# Altium project Project-Files-v2.PrjPcb
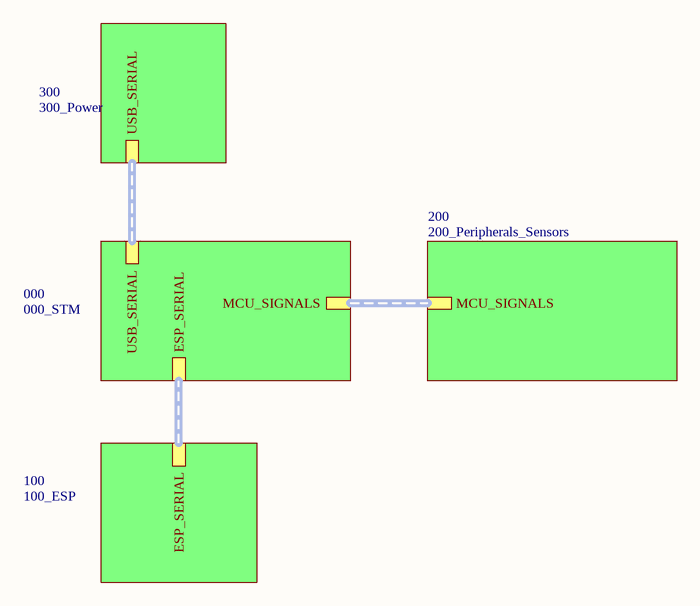
[diagram p0: Main.SchDoc]
4 sheets, 59 parts. Net scope: hierarchical (ports join the sheet entries above them; power ports are global).
Board file: PBC-full.PcbDoc
Sheets:
  Main.SchDoc
    100 = 100_ESP.SchDoc
    200 = 200_Peripherals_Sensors.SchDoc
    300 = 300_Power.SchDoc

## Sheet Main.SchDoc
size A; SheetNumber: 1; SheetTotal: 5

### Sub-sheets
000 = 000_STM (file not in this document): MCU_SIGNALS (harness MCU_SIGNALS), USB_SERIAL (harness USB_SERIAL), ESP_SERIAL (harness ESP_SERIAL)
100 = 100_ESP: ESP_SERIAL (harness ESP_SERIAL)
200 = 200_Peripherals_Sensors: MCU_SIGNALS (harness MCU_SIGNALS)
300 = 300_Power: USB_SERIAL (harness USB_SERIAL)

### Buses and harness runs
harness sheet 000/ESP_SERIAL = sheet 100/ESP_SERIAL
harness sheet 000/MCU_SIGNALS = sheet 200/MCU_SIGNALS
harness sheet 000/USB_SERIAL = sheet 300/USB_SERIAL

## Sheet 100_ESP.SchDoc
size A; SheetNumber: 3; SheetTotal: 5
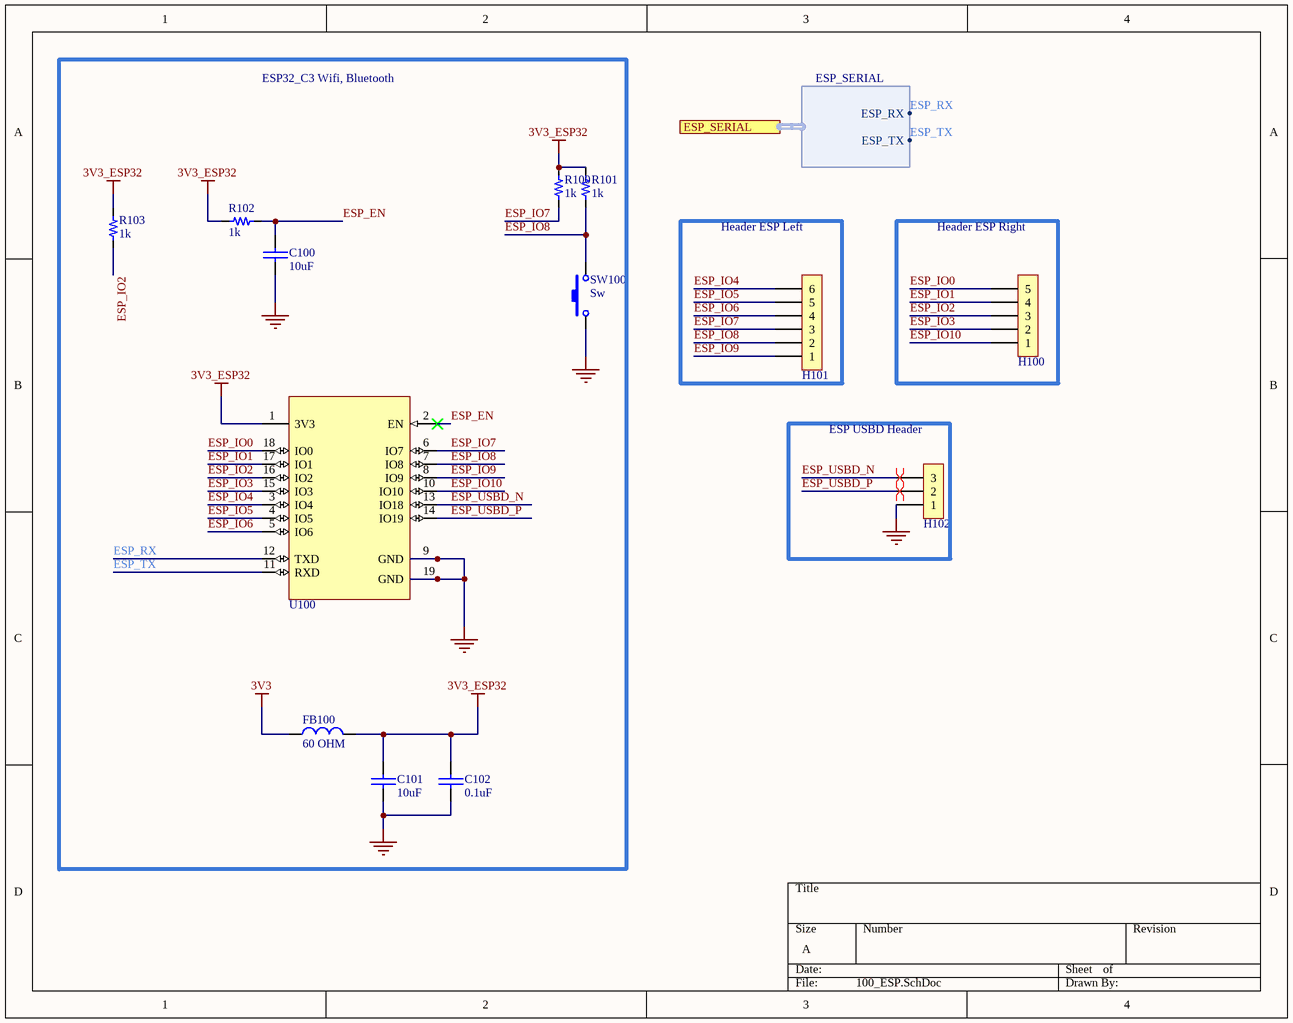
[diagram p1: 100_ESP.SchDoc]

### Parts
C100  value 10uF  [0805_cap]  (hidden comment: 10uF 25V)
C101  value 10uF  [0805_cap]  (hidden comment: 10uF 25V)
C102  value 0.1uF  [0603_cap]  (hidden comment: 0.1uF 50V)
FB100  value 60 OHM  [0603_fb]  (hidden comment: 60OHM 2A)
H100  5x1  [H_5x1_TH_100mil]  (value not drawn)  (no BOM)
H101  6x1  [H_6x1_TH_100mil]  (value not drawn)  (no BOM)
H102  3x1  [H_3X1_TH_100mil]  (value not drawn)  (no BOM)
R100  value 1k  [0603_res]  (hidden comment: 1k 1/10W)
R101  value 1k  [0603_res]  (hidden comment: 1k 1/10W)
R102  value 1k  [0603_res]  (hidden comment: 1k 1/10W)
R103  value 1k  [0603_res]  (hidden comment: 1k 1/10W)
SW100  Sw  [Sw_PUSH_4.5x4.5x5mm]
U100  ESP32-C3-WROOM-02-N4  [ESP32-C3-WROOM-02-N4]  (value not drawn)

### Blocks framed on the sheet
ESP32_C3 Wifi, Bluetooth: C100-C102 FB100 R100-R103 SW100 U100
Header ESP Left: H101
Header ESP Right: H100
ESP USBD Header: H102

### Ports
ESP_SERIAL (harness ESP_SERIAL, see Main[2B], 000_STM[3C])

### Harnesses
ESP_SERIAL: ESP_RX, ESP_TX

### Nets
3V3: FB100.1
3V3_ESP32: C101.1 C102.1 FB100.2 R100.2 R101.2 R102.2 R103.2 U100.1(3V3)
GND: C100.2 C101.2 C102.2 H102.1 SW100.1 U100.9(GND) U100.19(GND)
ESP_EN: C100.1 R102.1 U100.2(EN)
ESP_IO0: H100.5 U100.18(IO0)
ESP_IO1: H100.4 U100.17(IO1)
ESP_IO2: H100.3 R103.1 U100.16(IO2)
ESP_IO3: H100.2 U100.15(IO3)
ESP_IO4: H101.6 U100.3(IO4)
ESP_IO5: H101.5 U100.4(IO5)
ESP_IO6: H101.4 U100.5(IO6)
ESP_IO7: H101.3 R100.1 U100.6(IO7)
ESP_IO8: H101.2 R101.1 SW100.2 U100.7(IO8)
ESP_IO9: H101.1 U100.8(IO9)
ESP_IO10: H100.1 U100.10(IO10)
ESP_RX: U100.12(TXD) ; port ESP_SERIAL.ESP_RX
ESP_TX: U100.11(RXD) ; port ESP_SERIAL.ESP_TX
ESP_USBD_N: H102.3 U100.13(IO18)
ESP_USBD_P: H102.2 U100.14(IO19)

### Layout directives
differential pair; differential pair class USB_2.0_ESP: ESP_USBD_N, ESP_USBD_P

### Library data of the parts
C100 C101 = Cap_10uF_0805_25V_: 25V 10uF X5R ±10% 0805 Multilayer Ceramic Capacitors MLCC - SMD/SMT ROHS; Manufacturer: Samsung Electro-Mechanics; Manufacturer Part Number: CL21A106KAYNNNE; Supplier 1: LCSC; Supplier Part Number 1: C15850; ComponentLink1Description: LCSC; ComponentLink1URL: https://lcsc.com/product-detail/Multilayer-Ceramic-Capacitors-MLCC-SMD-SMT_Samsung-Electro-Mechanics-CL21A106KAYNNNE_C15850.html
C102 = Cap_0.1uF_0603_50V: 50V 100nF Y5V -20%~+80% 0603 Multilayer Ceramic Capacitors MLCC - SMD/SMT ROHS; Manufacturer: Walsin Tech Corp; Manufacturer Part Number: 0603F104Z500CT; Supplier 1: LCSC; Supplier Part Number 1: C83060; ComponentLink1Description: LCSC; ComponentLink1URL: https://www.lcsc.com/product-detail/Multilayer-Ceramic-Capacitors-MLCC-SMD-SMT_Walsin-Tech-Corp-0603F104Z500CT_C83060.html
FB100 = FB_60_0603_2A: 2A 1 100mΩ 60Ω@100MHz ±25% 0603 Ferrite Beads ROHS; Manufacturer: TAI-TECH; Manufacturer Part Number: HCB1608KF-600T20; ComponentLink1Description: LCSC; ComponentLink1URL: https://www.lcsc.com/product-detail/Ferrite-Beads_TAI-TECH-HCB1608KF-600T20_C369516.html; Supplier 1: LCSC; Supplier Part Number 1: C369516
H100 = H_Male_5x1_TH_100mil: ComponentLink1Description: LCSC
H101 = H_Male_6x1_TH_100mil: ComponentLink1Description: LCSC
H102 = H_Male_3x1_TH_100mil: ComponentLink1Description: LCSC
R100-R103 = Res_1k_0603_1/10W: RES SMD 1k OHM 5% 1/10W 0603; Manufacturer: FOJAN; Manufacturer Part Number: FRC0603J102 TS; ComponentLink1URL: https://www.lcsc.com/product-detail/Chip-Resistor-Surface-Mount_FOJAN-FRC0603J102-TS_C2907113.html; Supplier 1: LCSC; Supplier Part Number 1: C2907113; ComponentLink1Description: LCSC
SW100 = Sw_PUSH_4.5x4.5x5.0xmm: SWITCH TACTILE SPST-NO 0.05A 12V; Manufacturer: BZCN; Manufacturer Part Number: TSC015A05026A; Supplier 1: LCSC; Supplier Part Number 1: C2888509; Last modified by: N-A.Potosi; Last modified date: 20190222; ComponentLink1Description: LCSC; ComponentLink1URL: https://www.lcsc.com/product-detail/Tactile-Switches_BZCN-TSC015A05026A_C2888509.html
U100 = MCU_ESP32-C3-WROOM-02-N4: RF TXRX MOD BT WIFI PCB TH SMD; Manufacturer: Espressif Systems; Manufacturer Part Number: ESP32-C3-WROOM-02-N4; Supplier 1: LCSC; Supplier Part Number 1: C2934560; ComponentLink1Description: LCSC; ComponentLink1URL: https://lcsc.com/product-detail/WiFi-Modules_Espressif-Systems-ESP32-C3-WROOM-02-N4_C2934560.html

## Sheet 200_Peripherals_Sensors.SchDoc
size A; SheetNumber: 4; SheetTotal: 5
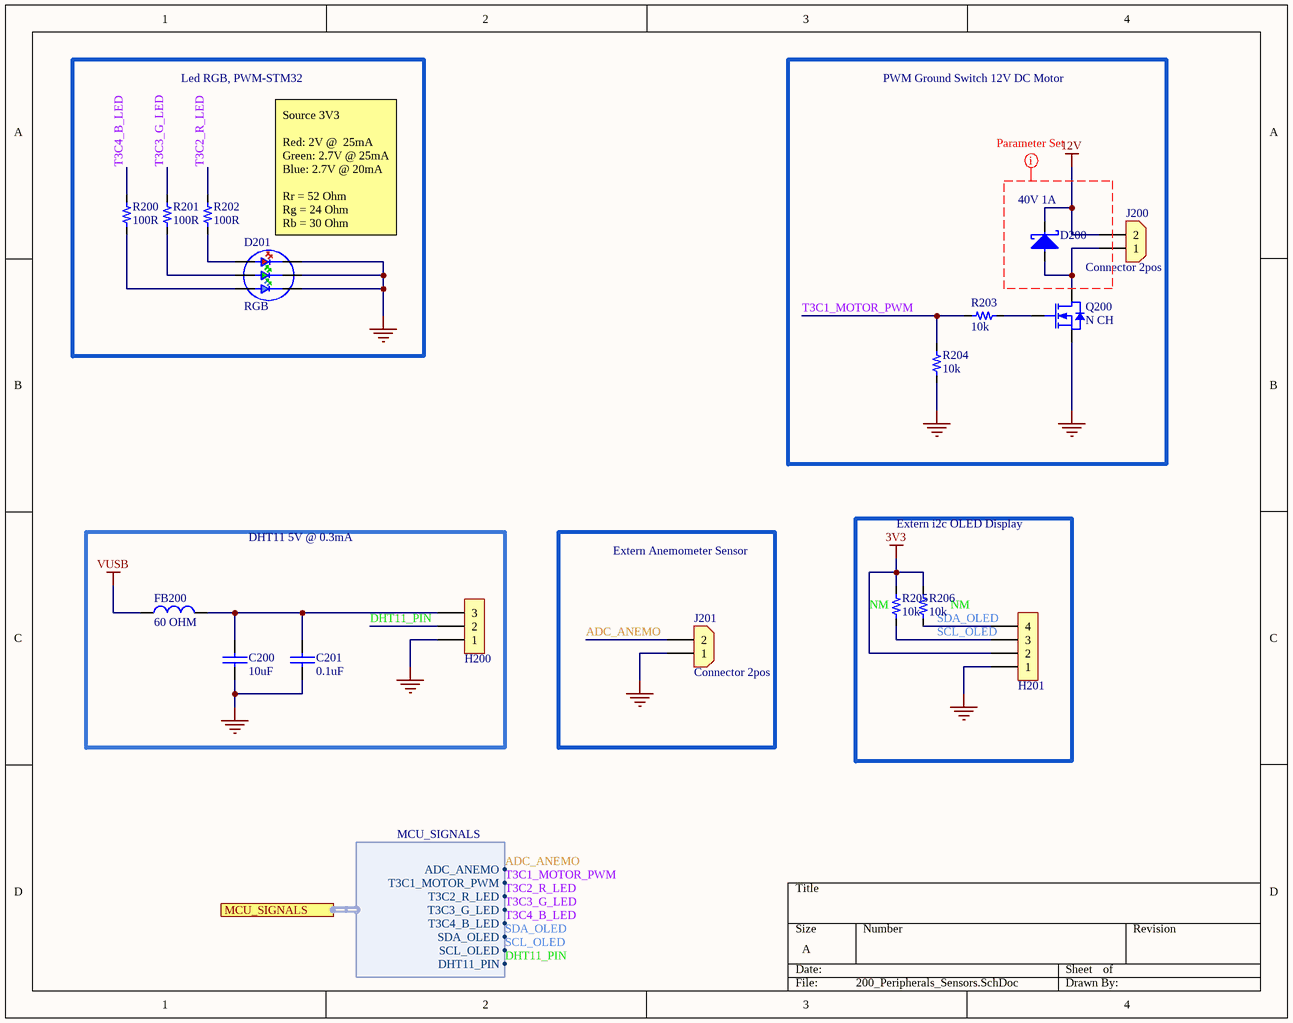
[diagram p2: 200_Peripherals_Sensors.SchDoc]

### Parts
C200  value 10uF  [0805_cap]  (hidden comment: 10uF 25V)
C201  value 0.1uF  [0603_cap]  (hidden comment: 0.1uF 50V)
D200  40V 1A  [SOD_123]
D201  RGB  [RGB_NS_3.5X3.7]
FB200  value 60 OHM  [0603_fb]  (hidden comment: 60OHM 2A)
H200  3x1  [H_3X1_TH_100mil]  (value not drawn)  (no BOM)
H201  4x1  [H_4x1_TH_2.54mm]  (value not drawn)  (no BOM)
J200  Connector 2pos  [CON_2x1_TH_5MM]
J201  Connector 2pos  [CON_2x1_TH_5MM]
Q200  N CH  [SOT_23_3]
R200  value 100R  [0603_res]  (hidden comment: 100R 1/10W)
R201  value 100R  [0603_res]  (hidden comment: 100R 1/10W)
R202  value 100R  [0603_res]  (hidden comment: 100R 1/10W)
R203  value 10k  [0603_res]  (hidden comment: 10k 1/10W)
R204  value 10k  [0603_res]  (hidden comment: 10k 1/10W)
R205  value 10k  Usage: NM  [0603_res]  (hidden comment: 10k 1/10W)
R206  value 10k  Usage: NM  [0603_res]  (hidden comment: 10k 1/10W)

### Blocks framed on the sheet
Led RGB, PWM-STM32: D201 R200-R202
PWM Ground Switch 12V DC Motor: D200 J200 Q200 R203 R204
DHT11 5V @ 0.3mA: C200 C201 FB200 H200
Extern Anemometer Sensor: J201
Extern i2c OLED Display: H201 R205 R206

### Ports
MCU_SIGNALS (harness MCU_SIGNALS, see Main[3B], 000_STM[3D])

### Harnesses
MCU_SIGNALS: ADC_ANEMO, T3C1_MOTOR_PWM, T3C2_R_LED, T3C3_G_LED, T3C4_B_LED, SDA_OLED, SCL_OLED, DHT11_PIN

### Nets
3V3: H201.2 R205.2 R206.2
12V: D200.1 J200.2
GND: C200.2 C201.2 D201.1 D201.2 D201.3 H200.1 H201.1 J201.1 Q200.2(S) R204.1
VUSB: FB200.1
ADC_ANEMO: J201.2 ; port MCU_SIGNALS.ADC_ANEMO
DHT11_PIN: H200.2 ; port MCU_SIGNALS.DHT11_PIN
SCL_OLED: H201.3 R205.1 ; port MCU_SIGNALS.SCL_OLED
SDA_OLED: H201.4 R206.1 ; port MCU_SIGNALS.SDA_OLED
T3C1_MOTOR_PWM: R203.2 R204.2 ; port MCU_SIGNALS.T3C1_MOTOR_PWM
T3C2_R_LED: R202.2 ; port MCU_SIGNALS.T3C2_R_LED
T3C3_G_LED: R201.2 ; port MCU_SIGNALS.T3C3_G_LED
T3C4_B_LED: R200.2 ; port MCU_SIGNALS.T3C4_B_LED
NetC200_1: C200.1 C201.1 FB200.2 H200.3
NetD200_2: D200.2 J200.1 Q200.3(D)
NetD201_4: D201.4 R202.1
NetD201_5: D201.5 R201.1
NetD201_6: D201.6 R200.1
NetQ200_1: Q200.1(G) R203.1

### Layout directives
net class 12V_2A: (no net found under the mark)

### Notes on the sheet
- (near D201) Source 3V3
  Red: 2V @  25mA
  Green: 2.7V @ 25mA
  Blue: 2.7V @ 20mA
  Rr = 52 Ohm
  Rg = 24 Ohm
  Rb = 30 Ohm

### Library data of the parts
C200 = Cap_10uF_0805_25V_: as C100 on sheet 100_ESP; Supplier 1: LCSC; Supplier Part Number 1: C15850; ComponentLink1Description: LCSC; ComponentLink1URL: https://lcsc.com/product-detail/Multilayer-Ceramic-Capacitors-MLCC-SMD-SMT_Samsung-Electro-Mechanics-CL21A106KAYNNNE_C15850.html
C201 = Cap_0.1uF_0603_50V: as C102 on sheet 100_ESP; Supplier 1: LCSC; Supplier Part Number 1: C83060; ComponentLink1Description: LCSC; ComponentLink1URL: https://www.lcsc.com/product-detail/Multilayer-Ceramic-Capacitors-MLCC-SMD-SMT_Walsin-Tech-Corp-0603F104Z500CT_C83060.html
D200 = D_Schottky_40V_1A_SOD_123F: DIODE SCHOTTKY 40V 1A SOD123F; Manufacturer: Shanghai Prisemi Elec; Manufacturer Part Number: PSBD1DF40V1H; Supplier 1: LCSC; Supplier Part Number 1: C110730; ComponentLink1Description: LCSC; ComponentLink1URL: https://www.lcsc.com/product-detail/Switching-Diode_Shanghai-Prisemi-Elec-PSBD1DF40V1H_C110730.html
D201 = LED_RGB_3535_SMD: -30℃~+85℃ RGB 110° 3535(mm) Light Emitting Diodes (LED) ROHS; Manufacturer: Foshan NationStar Optoelectronics; Manufacturer Part Number: RS-3535MWAM; Supplier 1: LCSC; Supplier Part Number 1: C842778; ComponentLink1Description: LCSC; ComponentLink1URL: https://www.lcsc.com/product-detail/Light-Emitting-Diodes-LED_Foshan-NationStar-Optoelectronics-RS-3535MWAM_C842778.html
FB200 = FB_60_0603_2A: as FB100 on sheet 100_ESP; ComponentLink1Description: LCSC; ComponentLink1URL: https://www.lcsc.com/product-detail/Ferrite-Beads_TAI-TECH-HCB1608KF-600T20_C369516.html; Supplier 1: LCSC; Supplier Part Number 1: C369516
H200 = H_Male_3x1_TH_100mil: ComponentLink1Description: LCSC
H201 = H_Male_4x1_TH_100mil: ComponentLink1Description: LCSC
J200 J201 = Con_2x1_TH_5mm: 2POS 5MM; Manufacturer: JILN; Manufacturer Part Number: JL126-50002G01; Supplier 1: LCSC; Supplier Part Number 1: C394556; ComponentLink1Description: Digi-Key; ComponentLink1URL: https://www.lcsc.com/product-detail/Screw-terminal_JILN-JL126-50002G01_C394556.html
Q200 = Q_NFET_20V_3.2A_SOT23: MOSFET N-CH 20V SOT23; Manufacturer: Doeshare; Manufacturer Part Number: DN2302S; Supplier 1: LCSC; Supplier Part Number 1: C2931750; ComponentLink1Description: LCSC; ComponentLink1URL: https://www.lcsc.com/product-detail/MOSFETs_Doeshare-DN2302S_C2931750.html
R200-R202 = Res_100R_0603_1/10W: RES SMD 100R OHM 5% 1/10W 0603; Manufacturer: FOJAN; Manufacturer Part Number: FRC0603J101 TS; ComponentLink1URL: https://www.lcsc.com/product-detail/Chip-Resistor-Surface-Mount_FOJAN-FRC0603J101-TS_C2907089.html; Supplier 1: LCSC; Supplier Part Number 1: C2907089; ComponentLink1Description: LCSC
R203-R206 = Res_10k_0603_1/10W: RES SMD 10k OHM 5% 1/10W 0603; Manufacturer: FOJAN; Manufacturer Part Number: FRC0603J103TS; ComponentLink1URL: https://www.lcsc.com/product-detail/Chip-Resistor-Surface-Mount_FOJAN-FRC0603J103TS_C2930027.html; Supplier 1: LCSC; Supplier Part Number 1: C2930027; ComponentLink1Description: LCSC

## Sheet 300_Power.SchDoc
size A; SheetNumber: 5; SheetTotal: 5
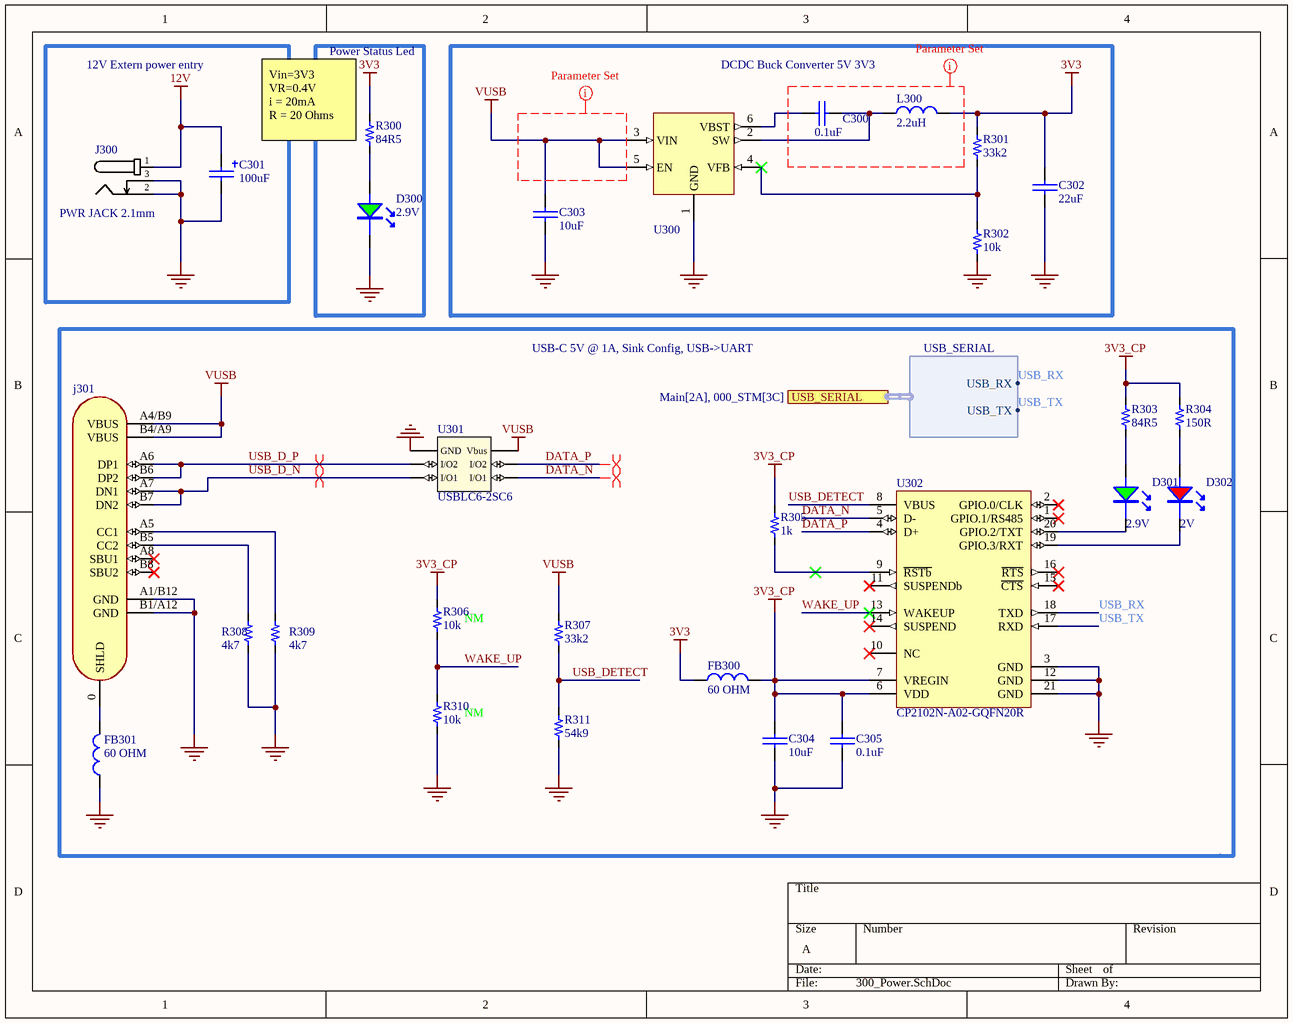
[diagram p3: 300_Power.SchDoc]

### Parts
C300  value 0.1uF  [0603_cap]  (hidden comment: 0.1uF 50V)
C301  value 100uF  [CAP_TH_2.5MM_6.3*12MM]  (hidden comment: 100uF 35V)
C302  value 22uF  [0603_cap]  (hidden comment: 22uF 10V)
C303  value 10uF  [0603_cap]  (hidden comment: 10uF 10V)
C304  value 10uF  [0603_cap]  (hidden comment: 10uF 10V)
C305  value 0.1uF  [0603_cap]  (hidden comment: 0.1uF 50V)
D300  2.9V  [0805_LED]
D301  2.9V  [0805_LED]
D302  2V  [0805_LED]
FB300  value 60 OHM  [0603_fb]  (hidden comment: 60OHM 2A)
FB301  value 60 OHM  [0603_fb]  (hidden comment: 60OHM 2A)
J300  PWR JACK 2.1mm  [CON_POWER_BARREL_2.1MM_3CONN]
j301  USB C  [CON_USB_C_16P_RA]  (value not drawn)
L300  value 2.2uH  [Ind_5.8*5.2_NS]  (hidden comment: 2.2uH 4A)
R300  value 84R5  [0603_res]  (hidden comment: 84R5 1/10W)
R301  value 33k2  [0603_res]  (hidden comment: 33k2 1/10W)
R302  value 10k  [0603_res]  (hidden comment: 10k 1/10W)
R303  value 84R5  [0603_res]  (hidden comment: 84R5 1/10W)
R304  value 150R  [0603_res]  (hidden comment: 150R 1/10W)
R305  value 1k  [0603_res]  (hidden comment: 1k 1/10W)
R306  value 10k  Usage: NM  [0603_res]  (hidden comment: 10k 1/10W)
R307  value 33k2  [0603_res]  (hidden comment: 33k2 1/10W)
R308  value 4k7  [0603_res]  (hidden comment: 4k7 1/10W)
R309  value 4k7  [0603_res]  (hidden comment: 4k7 1/10W)
R310  value 10k  Usage: NM  [0603_res]  (hidden comment: 10k 1/10W)
R311  value 54k9  [0603_res]  (hidden comment: 54k9 1/10W)
U300  TPS564201DDCR  [SOT_23_6]  (value not drawn)
U301  USBLC6-2SC6  [SOT_23_6]
U302  CP2102N-A02-GQFN20R  [WFQFN_20_EP_3X3MM]

### Blocks framed on the sheet
12V Extern power entry: C301 J300
Power Status Led: D300 R300
DCDC Buck Converter 5V 3V3: C300 C302 C303 L300 R301 R302 U300
USB-C 5V @ 1A, Sink Config, USB->UART: C304 C305 D301 D302 FB300 FB301 j301 R303-R311 U301 U302

### Ports
USB_SERIAL (harness USB_SERIAL, see Main[2A], 000_STM[3C])

### Harnesses
USB_SERIAL: USB_RX, USB_TX

### Nets
3V3: C302.1 FB300.1 L300.2 R300.1 R301.2
3V3_CP: C304.1 C305.1 FB300.2 R303.2 R304.2 R305.2 R306.2 U302.6(VDD) U302.7(VREGIN)
12V: C301.1 J300.1
GND: C301.2 C302.2 C303.2 C304.2 C305.2 D300.2 FB301.1 J300.2 J300.3 j301.A1/B12(GND) j301.B1/A12(GND) R302.1 R308.1 R309.1 R310.1 R311.1 U300.1(GND) U301.2(GND) U302.3(GND) U302.12(GND) U302.21(GND)
VUSB: C303.1 j301.A4/B9(VBUS) j301.B4/A9(VBUS) R307.2 U300.3(VIN) U300.5(EN) U301.5(Vbus)
DATA_N: U301.6(I/O1) U302.5(D-)
DATA_P: U301.4(I/O2) U302.4(D+)
USB_D_N: j301.A7(DN1) j301.B7(DN2) U301.1(I/O1)
USB_D_P: j301.A6(DP1) j301.B6(DP2) U301.3(I/O2)
USB_DETECT: R307.1 R311.2 U302.8(VBUS)
USB_RX: U302.18(TXD) ; port USB_SERIAL.USB_RX
USB_TX: U302.17(RXD) ; port USB_SERIAL.USB_TX
WAKE_UP: R306.1 R310.2 U302.13(WAKEUP)
NetC300_1: C300.1 L300.1 U300.2(SW)
NetC300_2: C300.2 U300.6(VBST)
NetD300_1: D300.1(A) R300.2
NetD301_1: D301.1(A) R303.1
NetD301_2: D301.2 U302.20(GPIO.2/TXT)
NetD302_1: D302.1(A) R304.1
NetD302_2: D302.2 U302.19(GPIO.3/RXT)
NetFB301_2: FB301.2 j301.0(SHLD)
Netj301_A5: j301.A5(CC1) R309.2
Netj301_B5: j301.B5(CC2) R308.2
NetR301_1: R301.1 R302.2 U300.4(VFB)
NetR305_1: R305.1 U302.9(~{RSTb})

Not connected (* = marked no-connect by the designer): j301 A8(SBU1)* B8(SBU2)*; U302 1(GPIO.1/RS485)* 2(GPIO.0/CLK)* 10(NC)* 11(SUSPENDb)* 14(SUSPEND)* 15(~{CTS})* 16(~{RTS})*

### Layout directives
differential pair; differential pair class USB_2.0_MCU: DATA_N, DATA_P, USB_D_N, USB_D_P
net class 5V_1A: (no net found under the mark)

### Notes on the sheet
- (near R300) Vin=3V3
  VR=0.4V
  i = 20mA
  R = 20 Ohms

### Library data of the parts
C300 C305 = Cap_0.1uF_0603_50V: as C102 on sheet 100_ESP; Supplier 1: LCSC; Supplier Part Number 1: C83060; ComponentLink1Description: LCSC; ComponentLink1URL: https://www.lcsc.com/product-detail/Multilayer-Ceramic-Capacitors-MLCC-SMD-SMT_Walsin-Tech-Corp-0603F104Z500CT_C83060.html
C301 = Cap_100uF_ALU_TH_35V: 100uF 35V ±20% Plugin,D6.3xL12mm Aluminum Electrolytic Capacitors - Leaded ROHS; Manufacturer: HRK; Manufacturer Part Number: 35V100uF CD110; Supplier 1: LCSC; Supplier Part Number 1: C2960381; ComponentLink1Description: LCSC; ComponentLink1URL: https://lcsc.com/product-detail/Aluminum-Electrolytic-Capacitors-Leaded_HRK-35V100uF-CD110_C2960381.html
C302 = Cap_22uF_0603_10V: 10V 22uF X5R ±20% 0603 Multilayer Ceramic Capacitors MLCC - SMD/SMT ROHS; Manufacturer: HRE; Manufacturer Part Number: CGA0603X5R226M100JT; Supplier 1: LCSC; Supplier Part Number 1: C6119863; ComponentLink1Description: LCSC; ComponentLink1URL: https://lcsc.com/product-detail/Multilayer-Ceramic-Capacitors-MLCC-SMD-SMT_HRE-CGA0603X5R226M100JT_C6119863.html
C303 C304 = Cap_10uF_0603_10V: 10V 10uF X5R ±10% 0603 Multilayer Ceramic Capacitors MLCC - SMD/SMT ROHS; Manufacturer: CCTC; Manufacturer Part Number: TCC0603X5R106K100CT; Supplier 1: LCSC; Supplier Part Number 1: C380314; ComponentLink1Description: LCSC; ComponentLink1URL: https://www.lcsc.com/product-detail/Multilayer-Ceramic-Capacitors-MLCC-SMD-SMT_CCTC-TCC0603X5R106K100CT_C380314.html
D300 D301 = LED_0805_Green: LED GREEN CLEAR 0805 SMD; Manufacturer: XINGLIGHT; Manufacturer Part Number: XL-2012UGC; Supplier 1: LCSC; Supplier Part Number 1: C965815; ComponentLink1Description: LCSC; ComponentLink1URL: https://www.lcsc.com/product-detail/Light-Emitting-Diodes-LED_XINGLIGHT-XL-2012UGC_C965815.html
D302 = LED_0805_RED: LED RED CLEAR 0805 SMD; Manufacturer: XINGLIGHT; Manufacturer Part Number: XL-2012SURC; Supplier 1: LCSC; Supplier Part Number 1: C965812; ComponentLink1Description: LCSC; ComponentLink1URL: https://www.lcsc.com/product-detail/Light-Emitting-Diodes-LED_XINGLIGHT-XL-2012SURC_C965812.html
FB300 FB301 = FB_60_0603_2A: as FB100 on sheet 100_ESP; ComponentLink1Description: LCSC; ComponentLink1URL: https://www.lcsc.com/product-detail/Ferrite-Beads_TAI-TECH-HCB1608KF-600T20_C369516.html; Supplier 1: LCSC; Supplier Part Number 1: C369516
J300 = Con_Power_Jack_2.1mm_3pins: CONN PWR JACK 2X5.5MM SOLDER; Manufacturer: HCTL; Manufacturer Part Number: HC-DC-005-2.0T; Supplier 1: LCSC; Supplier Part Number 1: C3010533; ComponentLink1Description: LCSC; ComponentLink1URL: https://www.lcsc.com/product-detail/AC-DC-Power-Connectors_HCTL-HC-DC-005-2-0T_C3010533.html
j301 = CON_USB_TYPEC_16P: 3A USB 3.1 1 Surface Mount 16P Female -40℃~+85℃ Type-C SMD USB Connectors ROHS; Manufacturer: SHOU HAN; Manufacturer Part Number: TYPE-C-3.1-16PIN; Supplier 1: LCSC; Supplier Part Number 1: C7507405; ComponentLink1Description: LCSC; ComponentLink1URL: https://lcsc.com/product-detail/USB-Connectors_SHOU-HAN-TYPE-C-3-1-16PIN_C7507405.html
L300 = Inductor_2.2uH_4A_5.8*5.2mm: 4A 2.2uH ±20% 22.1mΩ SMD,5.8x5.2mm Inductors (SMD) ROHS; Manufacturer: SHOU HAN; Manufacturer Part Number: CY54-2.2UH; Supplier 1: LCSC; Supplier Part Number 1: C2929427; ComponentLink1Description: LCSC; ComponentLink1URL: https://lcsc.com/product-detail/Inductors-SMD_SHOU-HAN-CY54-2-2UH_C2929427.html
R300 R303 = Res_84R5_0603_1/10W: 100mW Thick Film Resistor 50V ±100ppm/℃ ±1% 84.5Ω 0603 Chip Resistor - Surface Mount ROHS; Manufacturer: LIZ Elec; Manufacturer Part Number: CR0603FA84R5G; ComponentLink1URL: https://lcsc.com/product-detail/Chip-Resistor-Surface-Mount_LIZ-Elec-CR0603FA84R5G_C101216.html; Supplier 1: LCSC; Supplier Part Number 1: C101216; ComponentLink1Description: LCSC
R301 R307 = Res_33k2_0603_1/10W: 100mW Thick Film Resistor 75V ±100ppm/℃ ±1% 33.2kΩ 0603 Chip Resistor - Surface Mount ROHS; Manufacturer: YAGEO; Manufacturer Part Number: RC0603FR-0733K2L; ComponentLink1URL: https://lcsc.com/product-detail/Chip-Resistor-Surface-Mount_YAGEO-RC0603FR-0733K2L_C185338.html; Supplier 1: LCSC; Supplier Part Number 1: C185338; ComponentLink1Description: LCSC
R302 R306 R310 = Res_10k_0603_1/10W: as R203 on sheet 200_Peripherals_Sensors; ComponentLink1URL: https://www.lcsc.com/product-detail/Chip-Resistor-Surface-Mount_FOJAN-FRC0603J103TS_C2930027.html; Supplier 1: LCSC; Supplier Part Number 1: C2930027; ComponentLink1Description: LCSC
R304 = Res_150R_0603_1/10W: 100mW Thick Film Resistor 75V ±100ppm/℃ ±1% 150Ω 0603 Chip Resistor - Surface Mount ROHS; Manufacturer: RALEC; Manufacturer Part Number: RTT031500FTP; ComponentLink1URL: https://lcsc.com/product-detail/Chip-Resistor-Surface-Mount_RALEC-RTT031500FTP_C103302.html; Supplier 1: LCSC; Supplier Part Number 1: C103302; ComponentLink1Description: LCSC
R305 = Res_1k_0603_1/10W: as R100 on sheet 100_ESP; ComponentLink1URL: https://www.lcsc.com/product-detail/Chip-Resistor-Surface-Mount_FOJAN-FRC0603J102-TS_C2907113.html; Supplier 1: LCSC; Supplier Part Number 1: C2907113; ComponentLink1Description: LCSC
R308 R309 = Res_4k7_0603_1/10W: 100mW Thick Film Resistor 75V ±1% 4.7kΩ 0603 Chip Resistor - Surface Mount ROHS; Manufacturer: VO; Manufacturer Part Number: SCR0603F4K7; ComponentLink1URL: https://lcsc.com/product-detail/Chip-Resistor-Surface-Mount_VO-SCR0603F4K7_C3016318.html; Supplier 1: LCSC; Supplier Part Number 1: C3016318; ComponentLink1Description: LCSC
R311 = Res_54k9_0603_1/10W: 100mW Thick Film Resistor 75V ±100ppm/℃ ±1% 54.9kΩ 0603 Chip Resistor - Surface Mount ROHS; Manufacturer: YAGEO; Manufacturer Part Number: RC0603FR-0754K9L; ComponentLink1URL: https://lcsc.com/product-detail/Chip-Resistor-Surface-Mount_YAGEO-RC0603FR-0754K9L_C185321.html; Supplier 1: LCSC; Supplier Part Number 1: C185321; ComponentLink1Description: LCSC
U300 = DCDC_SW_BUCK_4A_SOT23-6: IC REG BUCK ADJ 4A SOT23; Manufacturer: Texas Instruments; Manufacturer Part Number: TPS564201DDCR; Supplier 1: LCSC; Supplier Part Number 1: C464812; ComponentLink1Description: LCSC; ComponentLink1URL: https://lcsc.com/product-detail/DC-DC-Converters_Texas-Instruments-TPS564201DDCR_C464812.html
U301 = TVS_5.25V_2CH_SOT_23_6: TVS DIODE 5.25V 17V SOT23-6; Manufacturer: STMicroelectronics; ComponentLink1Description: LCSC; ComponentLink1URL: https://www.lcsc.com/product-detail/ESD-Protection-Devices_STMicroelectronics-USBLC6-2SC6_C7519.html; Supplier 1: LCSC; Manufacturer Part Number: USBLC6-2SC6; Supplier Part Number 1: C7519
U302 = IC_SGL_USB2UART-BRIDGE_20QFN: IC USB TO UART BRIDGE QFN20; Manufacturer: Silicon Labs; Manufacturer Part Number: CP2102N-A02-GQFN20R; Supplier 1: LCSC; Supplier Part Number 1: C969913; ComponentLink1Description: LCSC; ComponentLink1URL: https://www.lcsc.com/product-detail/USB-ICs_SILICON-LABS-CP2102N-A02-GQFN20R_C969913.html

## Nets that join several sheets
3V3: 100_ESP (FB100.1), 200_Peripherals_Sensors (H201.2 R205.2 R206.2), 300_Power (5 pins)
12V: 200_Peripherals_Sensors (D200.1 J200.2), 300_Power (C301.1 J300.1)
GND: 100_ESP (7 pins), 200_Peripherals_Sensors (10 pins), 300_Power (21 pins)
VUSB: 200_Peripherals_Sensors (FB200.1), 300_Power (7 pins)